# Altium schematic sheet BMU_V50_MCUcomplex.SchDoc
size C
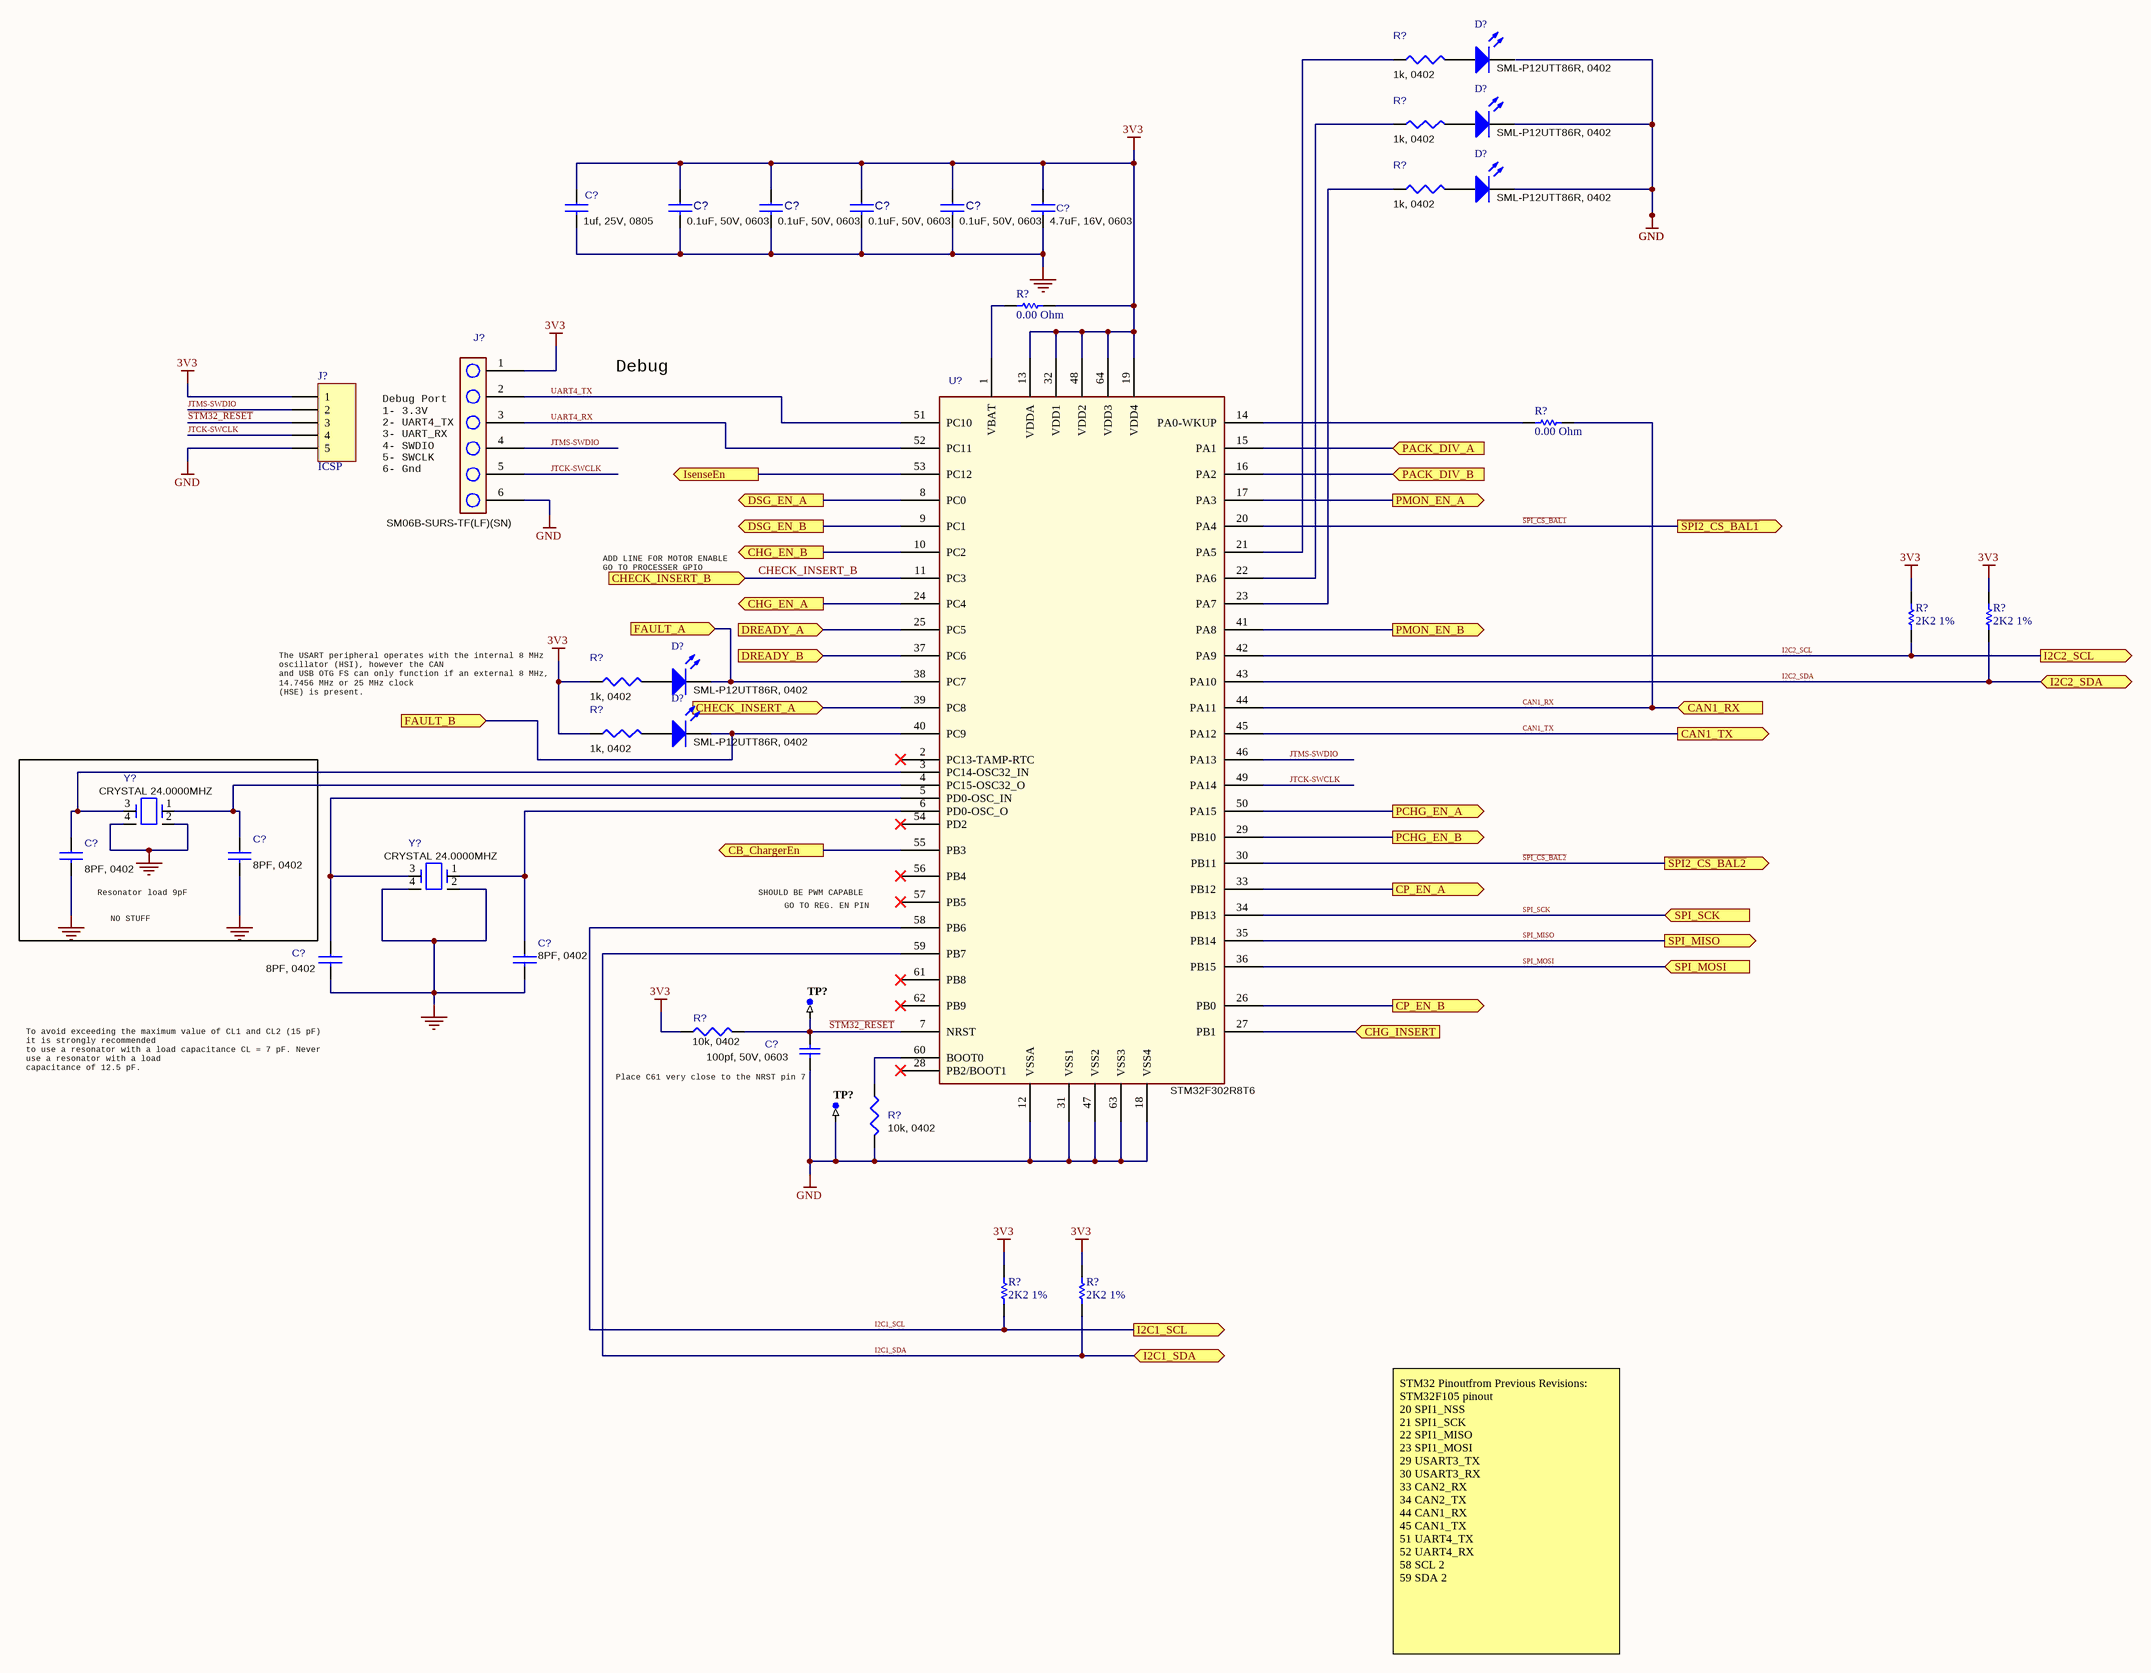
[diagram p0: BMU_V50_MCUcomplex.SchDoc]

## Parts
(Parts that share a designator on the sheet are numbered #1, #2 ... from top to bottom, then left to right.)
C?#1  1uf, 25V, 0805  [C0805]
C?#2  0.1uF, 50V, 0603  [C0603]
C?#3  0.1uF, 50V, 0603  [C0603]
C?#4  0.1uF, 50V, 0603  [C0603]
C?#5  0.1uF, 50V, 0603  [C0603]
C?#6  4.7uF, 16V, 0603  [C0805]
C?#7  8PF, 0402  [C0402]
C?#8  8PF, 0402  [C0402]
C?#9  8PF, 0402  [C0402]
C?#10  8PF, 0402  [C0402]
C?#11  100pf, 50V, 0603  [C0603]
D?#1  SML-P12UTT86R, 0402  [D0402_1]
D?#2  SML-P12UTT86R, 0402  [D0402_1]
D?#3  SML-P12UTT86R, 0402  [D0402_1]
D?#4  SML-P12UTT86R, 0402  [D0402_1]
D?#5  SML-P12UTT86R, 0402  [D0402_1]
J?#1  SM06B-SURS-TF(LF)(SN)  [0.8mm]
J?#2  ICSP  [TC2030-MCP-NL]  (no BOM)
R?#1  1k, 0402  [R0402]
R?#2  1k, 0402  [R0402]
R?#3  1k, 0402  [R0402]
R?#4  value 0.00 Ohm  [RESC0402(1005)_L]  (hidden comment: Jumper 0402(1005))
R?#5  value 0.00 Ohm  [RESC0402(1005)_L]  (hidden comment: Jumper 0402(1005))
R?#6  2K2 1%  [RESC0402(1005)_L]
R?#7  2K2 1%  [RESC0402(1005)_L]
R?#8  1k, 0402  [R0402]
R?#9  1k, 0402  [R0402]
R?#10  10k, 0402  [R0402]
R?#11  10k, 0402  [R0402]
R?#12  2K2 1%  [RESC0402(1005)_L]
R?#13  2K2 1%  [RESC0402(1005)_L]
TP?#1  TP-SM-C-100  [TP-SM-C-100]  (value not drawn)  (no BOM)
TP?#2  TP-SM-C-100  [TP-SM-C-100]  (value not drawn)  (no BOM)
U?  STM32F302R8T6  [64LQFP]
Y?#1  CRYSTAL 24.0000MHZ  [CRYSTAL_NX3225SA]
Y?#2  CRYSTAL 24.0000MHZ  [CRYSTAL_NX3225SA]

## Ports
CAN1_RX (in), CAN1_TX (out), CB_ChargerEn (out), CHECK_INSERT_A (in), CHECK_INSERT_B (in), CHG_EN_A (out), CHG_EN_B (out), CHG_INSERT (in), CP_EN_A (out), CP_EN_B (out), DREADY_A (in), DREADY_B (in), DSG_EN_A (out), DSG_EN_B (out), FAULT_A (in), FAULT_B (in), I2C1_SCL (out), I2C1_SDA (bidir), I2C2_SCL (out), I2C2_SDA (bidir), IsenseEn (out), PACK_DIV_A (in), PACK_DIV_B (in), PCHG_EN_A (out), PCHG_EN_B (out), PMON_EN_A (out), PMON_EN_B (out), SPI_MISO (out), SPI_MOSI (in), SPI_SCK (in), ~{SPI2_CS_BAL1} (out), ~{SPI2_CS_BAL2} (out)

## Nets
3V3: C?#1.1 C?#2.1 C?#3.1 C?#4.1 C?#5.1 C?#6.1 J?#1.1 J?#2.1 R?#4.1 R?#6.2 R?#7.2 R?#8.1 R?#9.1 R?#10.1 R?#12.2 R?#13.2 U?.13(VDDA) U?.19(VDD4) U?.32(VDD1) U?.48(VDD2) U?.64(VDD3)
GND: C?#1.2 C?#2.2 C?#3.2 C?#4.2 C?#5.2 C?#6.2 C?#7.2 C?#8.2 C?#9.2 C?#10.2 C?#11.1 D?#2.2(K) D?#3.2(K) J?#1.6 J?#2.5 R?#11.2 TP?#2.1 U?.12(VSSA) U?.18(VSS4) U?.31(VSS1) U?.47(VSS2) U?.63(VSS3) Y?#1.2 Y?#1.4 Y?#2.2 Y?#2.4
CAN1_RX: R?#5.1 U?.44(PA11) ; port CAN1_RX
CAN1_TX: U?.45(PA12) ; port CAN1_TX
CB_ChargerEn: U?.55(PB3) ; port CB_ChargerEn
CHECK_INSERT_A: U?.39(PC8) ; port CHECK_INSERT_A
CHECK_INSERT_B: U?.11(PC3) ; port CHECK_INSERT_B
CHG_EN_A: U?.24(PC4) ; port CHG_EN_A
CHG_EN_B: U?.10(PC2) ; port CHG_EN_B
CHG_INSERT: U?.27(PB1) ; port CHG_INSERT
CP_EN_A: U?.33(PB12) ; port CP_EN_A
CP_EN_B: U?.26(PB0) ; port CP_EN_B
DREADY_A: U?.25(PC5) ; port DREADY_A
DREADY_B: U?.37(PC6) ; port DREADY_B
DSG_EN_A: U?.8(PC0) ; port DSG_EN_A
DSG_EN_B: U?.9(PC1) ; port DSG_EN_B
FAULT_A: D?#4.2(K) U?.38(PC7) ; port FAULT_A
FAULT_B: D?#5.2(K) U?.40(PC9) ; port FAULT_B
I2C1_SCL: R?#12.1 U?.58(PB6) ; port I2C1_SCL
I2C1_SDA: R?#13.1 U?.59(PB7) ; port I2C1_SDA
I2C2_SCL: R?#6.1 U?.42(PA9) ; port I2C2_SCL
I2C2_SDA: R?#7.1 U?.43(PA10) ; port I2C2_SDA
IsenseEn: U?.53(PC12) ; port IsenseEn
JTCK-SWCLK: J?#1.5 J?#2.4 U?.49(PA14)
JTMS-SWDIO: J?#1.4 J?#2.2 U?.46(PA13)
PACK_DIV_A: U?.15(PA1) ; port PACK_DIV_A
PACK_DIV_B: U?.16(PA2) ; port PACK_DIV_B
PCHG_EN_A: U?.50(PA15) ; port PCHG_EN_A
PCHG_EN_B: U?.29(PB10) ; port PCHG_EN_B
PMON_EN_A: U?.17(PA3) ; port PMON_EN_A
PMON_EN_B: U?.41(PA8) ; port PMON_EN_B
~{SPI_CS_BAL1}: U?.20(PA4) ; port ~{SPI2_CS_BAL1}
~{SPI_CS_BAL2}: U?.30(PB11) ; port ~{SPI2_CS_BAL2}
~{STM32_RESET}: C?#11.2 J?#2.3 R?#10.2 TP?#1.1 U?.7(NRST)
SPI_MISO: U?.35(PB14) ; port SPI_MISO
SPI_MOSI: U?.36(PB15) ; port SPI_MOSI
SPI_SCK: U?.34(PB13) ; port SPI_SCK
UART4_RX: J?#1.3 U?.52(PC11)
UART4_TX: J?#1.2 U?.51(PC10)
NetC?#7_1: C?#7.1 U?.3(PC14-OSC32_IN) Y?#1.3
NetC?#8_1: C?#8.1 U?.4(PC15-OSC32_O) Y?#1.1
NetC?#9_1: C?#9.1 U?.5(PD0-OSC_IN) Y?#2.3
NetC?#10_1: C?#10.1 U?.6(PD0-OSC_O) Y?#2.1
NetR?#1_1: R?#1.1 U?.21(PA5)
NetR?#2_1: R?#2.1 U?.22(PA6)
NetR?#3_1: R?#3.1 U?.23(PA7)
NetR?#4_2: R?#4.2 U?.1(VBAT)
NetR?#5_2: R?#5.2 U?.14(PA0-WKUP)
NetR?#11_1: R?#11.1 U?.60(BOOT0)

Not connected (* = marked no-connect by the designer): D?#1 1(A) 2(K); D?#2 1(A); D?#3 1(A); D?#4 1(A); D?#5 1(A); R?#1 2; R?#2 2; R?#3 2; R?#8 2; R?#9 2; U? 2(PC13-TAMP-RTC)* 28(PB2/BOOT1)* 54(PD2)* 56(PB4)* 57(PB5)* 61(PB8)* 62(PB9)*

## Notes on the sheet
- Debug
- (near J?#1) Debug Port
  1- 3.3V
  2- UART4_TX
  3- UART_RX
  4- SWDIO
  5- SWCLK
  6- Gnd
- ADD LINE FOR MOTOR ENABLE
  GO TO PROCESSER GPIO
- (near R?#8) The USART peripheral operates with the internal 8 MHz
  oscillator (HSI), however the CAN
  and USB OTG FS can only function if an external 8 MHz,
  14.7456 MHz or 25 MHz clock
  (HSE) is present.
- (near C?#7) Resonator load 9pF
- NO STUFF
- SHOULD BE PWM CAPABLE
- GO TO REG. EN PIN
- To avoid exceeding the maximum value of CL1 and CL2 (15 pF)
  it is strongly recommended
  to use a resonator with a load capacitance CL = 7 pF. Never
  use a resonator with a load
  capacitance of 12.5 pF.
- (near C?#11) Place C61 very close to the NRST pin 7
- STM32 Pinoutfrom Previous Revisions:
  STM32F105 pinout
  20 SPI1_NSS
  21 SPI1_SCK
  22 SPI1_MISO
  23 SPI1_MOSI
  29 USART3_TX
  30 USART3_RX
  33 CAN2_RX
  34 CAN2_TX
  44 CAN1_RX
  45 CAN1_TX
  51 UART4_TX
  52 UART4_RX
  58 SCL 2
  59 SDA 2
- Title
- MATTERNET
- PROPRIETRY & CONFIDENTIAL
  THE INFORMATION CONTAINS IN THIS DRAWING
  IS THE SOLE PROPERTY OF  MATTERNET Inc.
  ANY REPRODUCTION IN PART OR AS WHOLE
  WITHOUT A WRITTEN PERMISSION OF
  MATTERNET Inc. IS PROHIBITED
- Size:
- Date:
- File:
- C
- Number:
- Time:
- Revision:
- Sheet
- of
- 161 E. Evelyn Ave.
- Mountain View,
- CA 94041 USA

## Library data of the parts
C?#1 = CAP-Generic-0402: CAP CER 1UF 25V X7R 0805; Manufacturer: Murata; Manufacturer Part Number: GCJ21BR71E105KA12L; Tolerance: 10%; Supplier 1: Digi-Key; Supplier Part Number 1: 490-5802-1-ND; Stock 1: 116649; Pricing 1: 1=0.48, 10=0.333, 100=0.1997, 500=0.14974, 1000=0.12645 (USD); Mount: Surface Mount; Case/Package: 0805; Case Code (Imperial): 0805; Case Code (Metric): 2012; Min Operating Temperature: -55°C; Max Operating Temperature: 125°C; Capacitance: 1uF; Voltage Rating: 25V; Voltage Rating (DC): 25V; Packaging: Tape and Reel; Package Quantity: 3000; Dielectric: X7R; Termination: SMD/SMT; Features: Soft Termination; Length: 2mm; Width: 1.25mm; Thickness: 0.057inch; Depth: 1.25mm; Ratings: AEC-Q200; Lead Free: Lead Free
C?#2-C?#5 = CAP-Generic-0603: CAP CER 0.1UF 50V 10% X7R 0603; Manufacturer: Murata; Manufacturer Part Number: GCJ188R71E104KA12D; Supplier 1: Digi-Key; Supplier Part Number 1: 490-16477-1-ND; Stock 1: 2560; Pricing 1: 1=0.22, 10=0.152, 100=0.077, 500=0.0527, 1000=0.04662 (USD); Case/Package: 0603; Supplier 2: Mouser; Supplier Part Number 2: 81-GCJ188R71E104KA2D; Stock 2: 47905; Pricing 2: 1=0.21, 10=0.139, 50=0.139, 100=0.071, 1000=0.043, 10000=0.035 (USD)
C?#6 = CAP-Generic-0603: CAP CER 4.7UF 16V 10% X7R 0805; Manufacturer: TDK; Manufacturer Part Number: CGA4J3X7R1C475K125AE; Supplier 1: Digi-Key; Supplier Part Number 1: 445-8788-1-ND; Stock 1: 255080; Pricing 1: 1=0.7, 10=0.498, 100=0.3279, 500=0.24288, 1000=0.20645 (USD); Mount: Surface Mount; Case/Package: 0805; Weight: 0.000194oz; Case Code (Imperial): 0805; Case Code (Metric): 2012; Min Operating Temperature: -55°C; Max Operating Temperature: 125°C; Capacitance: 4.7uF; Tolerance: 10%; Packaging: Tape and Reel; Voltage Rating: 16V; Termination: SMD/SMT; Voltage Rating (DC): 16V; Package Quantity: 1; Dielectric: X7R; Features: Soft Termination; Length: 2mm; Height: 1.25mm; Width: 1.2mm; Thickness: 0.057inch; Depth: 1.25mm; Ratings: AEC-Q200; REACH SVHC: No SVHC; ComponentLink1URL: http://www.mouser.com/ds/2/400/lcc_commercial_soft_en-775842.pdf?src-supplier=Mouser; ComponentLink1Description: http://www.mouser.com/ds/2/400/lcc_commercial_soft_en-775842.pdf?src-supplier=Mouser; ComponentLink2URL: http://www.farnell.com/datasheets/1863333.pdf?src-supplier=Element14; ComponentLink2Description: http://www.farnell.com/datasheets/1863333.pdf?src-supplier=Element14; Supplier 2: Mouser; Supplier Part Number 2: 810-CGA4J3X7R1C475KS; Stock 2: 3160; Pricing 2: 1=0.7, 10=0.498, 50=0.498, 100=0.328, 1000=0.207, 10000=0.176 (USD)
C?#7-C?#10 = CAP-Generic-0402: CAP CER 8PF 50V C0G 0402; Manufacturer: TDK; Manufacturer Part Number: CGA2B2C0G1H080D050BA; ComponentLink1URL: http://www.mouser.com/ds/2/400/lcc_commercial_general_en-837201.pdf; ComponentLink1Description: http://www.mouser.com/ds/2/400/lcc_commercial_general_en-837201.pdf; ComponentLink2URL: https://product.tdk.com/info/en/documents/chara_sheet/C1005C0G1H080C050BA.pdf; ComponentLink2Description: https://product.tdk.com/info/en/documents/chara_sheet/C1005C0G1H080C050BA.pdf; Supplier 1: Digi-Key; Supplier Part Number 1: 445-5582-1-ND; Stock 1: 4049; Pricing 1: 1=0.1, 10=0.076, 100=0.0338, 500=0.02416, 1000=0.01898, 2500=0.01725, 5000=0.01587 (USD); Mount: Surface Mount; Case/Package: 0402; Weight: 2.3E-05oz; Case Code (Imperial): 0402; Case Code (Metric): 1005; Min Operating Temperature: -55°C; Max Operating Temperature: 125°C; Capacitance: 8pF; Voltage Rating: 50V; Voltage Rating (DC): 50V; Packaging: Tape and Reel; Dielectric: C0G; Termination: SMD/SMT; Package Quantity: 10000; Composition: Ceramic; Length: 1mm; Height: 0.5mm; Width: 0.5mm; Thickness: 0.022inch; Depth: 0.5mm; Ratings: AEC-Q200; REACH SVHC: No SVHC; ComponentLink3URL: http://www.mouser.com/ds/2/400/lcc_automotive_general_en-843974.pdf; ComponentLink3Description: http://www.mouser.com/ds/2/400/lcc_automotive_general_en-843974.pdf; ComponentLink4URL: http://www.farnell.com/datasheets/1807242.pdf; ComponentLink4Description: http://www.farnell.com/datasheets/1807242.pdf
C?#11 = Cap: CAP CER 100PF 50V NP0 0603; Manufacturer: TDK; Manufacturer Part Number: CGA3E2C0G1H101J080AE; Tolerance: 5%; Supplier 1: Digi-Key; Supplier Part Number 1: 445-173653-1-ND; Stock 1: 2011; Pricing 1: 1=0.27, 10=0.186, 100=0.0944, 500=0.06458, 1000=0.05713 (USD); Mount: Surface Mount; Case/Package: 0603; Case Code (Metric): 1608; Case Code (Imperial): 0603; Min Operating Temperature: -55°C; Max Operating Temperature: 125°C; Packaging: Tape and Reel; Capacitance: 100pF; Voltage Rating: 50V; Features: Soft Termination; Length: 0.063inch; Width: 0.031inch; Thickness: 0.037inch; Ratings: AEC-Q200; Supplier 2: Mouser; Supplier Part Number 2: 810-CGA3E2C0G1H101JA; Stock 2: 41170; Pricing 2: 1=0.27, 10=0.186, 50=0.186, 100=0.095, 1000=0.058, 10000=0.044 (USD)
D?#1-D?#5 = LED0: LED Uni-Color Red Chip LED 2-Pin 0402 T/R; Manufacturer: Rohm; Manufacturer Part Number: SML-P12U2TT86R; Lens Color: Colorless; Lens Transparency: Clear; Luminous Intensity: 70mcd; Test Current: 20mA; Dominant Wavelength: 615nm; Forward Voltage: 2V; Supplier 1: Digi-Key; Supplier Part Number 1: 846-1192-1-ND; Stock 1: 9518; Pricing 1: 1=0.45, 10=0.327, 25=0.2504, 100=0.1634, 250=0.1198, 500=0.10164, 1000=0.08349, 2500=0.0726 (USD); Mount: Surface Mount; Case/Package: 0402; Color: Red; Case Code (Metric): 1006; Case Code (Imperial): 0402; Packaging: Cut Tape; Length: 1mm; Height: 0.25mm; Width: 0.6mm; Lead Free: Lead Free; Supplier 2: Mouser; Supplier Part Number 2: 755-SML-P12U2TT86R; Stock 2: 13361; Pricing 2: 1=0.37, 10=0.238, 50=0.238, 100=0.102, 1000=0.079, 10000=0.06 (USD)
J?#1 = CONN-GENERIC-1X6: Headers & Wire Housings 6P SR UNSHRD HRD TIN OVER NI; Manufacturer: JST; custprt: 100-0410-000212; custinv: Ansync; Option: A; Number of Positions: 6; Connector Type: Outer Shroud Contact; Pitch: 0.031inch; Supplier 1: Digi-Key; Supplier Part Number 1: SM06B-SURS-TF(LF)(SN)-ND; Manufacturer Part Number: SM06B-SURS-TF(LF)(SN); Stock 1: 0; Pricing 1: 3500=0.43193 (USD); Mount: Surface Mount; Colour: Natural; Contact Plating: Tin; Number of Rows: 1; Packaging: Tape and Reel; Termination: Solder; ComponentLink1URL: http://www.jst-mfg.com/product/pdf/eng/eSUR.pdf; ComponentLink1Description: http://www.jst-mfg.com/product/pdf/eng/eSUR.pdf
R?#1-R?#3 R?#8 R?#9 = R-Generic-0402: RES SMD 1K OHM 5% 1/16W 0402; Manufacturer: Yageo; Manufacturer Part Number: RC0402JR-071KL; custinv: Ansync; custprt: 100-0120-000074; Option: AB; Resistance: 1kR; Power Rating: 62.5mW; Voltage Rating: 50V; Temperature Coefficient: 100ppm/°C; Max Power Dissipation: 63mW; Supplier 1: Digi-Key; Supplier Part Number 1: 311-1.0KJRCT-ND; Stock 1: 18546768; Pricing 1: 1=0.1, 10=0.015, 100=0.006, 1000=0.00268, 2500=0.00233, 5000=0.00192 (USD); Case/Package: 0402; Case Code (Imperial): 0402; Case Code (Metric): 1005; Min Operating Temperature: -55°C; Max Operating Temperature: 155°C; Tolerance: 5%; Packaging: Tape and Reel; Package Quantity: 1; Termination: SMD/SMT; Composition: Thick Film; Number of Terminations: 2; Military Standard: Not; Features: Moisture Resistant; Length: 0.039inch; Height: 0.016inch; Width: 0.02inch; Depth: 0.5mm; REACH SVHC: No SVHC; Lead Free: Lead Free; ComponentLink1URL: http://www.yageo.com/documents/recent/PYu-RC_Group_51_RoHS_L_9.pdf; ComponentLink1Description: http://www.yageo.com/documents/recent/PYu-RC_Group_51_RoHS_L_9.pdf; ComponentLink2URL: http://www.farnell.com/datasheets/1018594.pdf; ComponentLink2Description: http://www.farnell.com/datasheets/1018594.pdf; ComponentLink3URL: http://www.yageo.com/documents/recent/PYu-RC0402_51_RoHS_L_6_r.pdf; ComponentLink3Description: http://www.yageo.com/documents/recent/PYu-RC0402_51_RoHS_L_6_r.pdf
R?#4 R?#5 = CMP-1011-00001-1: Jumper 0402 (1005 Metric); Tolerance: None; Case-Metric: 1005; Case-EIA: 0402; Power: None; Technology: SMT
R?#6 R?#7 R?#12 R?#13 = CMP-1011-00546-1: 2K2 0.063W 1% 0402 (1005 Metric)  SMD; Case-Metric: 1005; Case-EIA: 0402; Value: 2200.00 Ohm; Power: 0.063 W; Tolerance: 1 %; Technology: SMT
R?#10 R?#11 = R-Generic-0402: RES SMD 10K OHM 1% 1/16W 0402; Manufacturer: Vishay Dale; Manufacturer Part Number: CRCW040210K0FKTD; Resistance: 10kR; Power Rating: 63mW; Voltage Rating: 50V; Temperature Coefficient: 100ppm/°C; ComponentLink1URL: http://www.yageo.com/documents/recent/PYu-RC_Group_51_RoHS_L_9.pdf; ComponentLink1Description: http://www.yageo.com/documents/recent/PYu-RC_Group_51_RoHS_L_9.pdf; ComponentLink2URL: http://www.mouser.com/ds/2/447/PYu-RC0402_51_RoHS_L_6_r-8721.pdf; ComponentLink2Description: http://www.mouser.com/ds/2/447/PYu-RC0402_51_RoHS_L_6_r-8721.pdf; ComponentLink3URL: http://www.farnell.com/datasheets/1018594.pdf; ComponentLink3Description: http://www.farnell.com/datasheets/1018594.pdf; Supplier 1: Digi-Key; Supplier Part Number 1: 541-2955-1-ND; Stock 1: 17223; Pricing 1: 1=0.15, 10=0.132, 100=0.0508, 1000=0.02236, 2500=0.01931, 5000=0.01728 (USD); Mount: Surface Mount; Case/Package: 0402; Number of Pins: 2; Weight: 2.3E-05oz; Case Code (Metric): 1005; Case Code (Imperial): 0402; Contact Plating: Lead,Tin; Min Operating Temperature: -55°C; Max Operating Temperature: 155°C; Tolerance: 1%; Packaging: Tape and Reel; Package Quantity: 10000; Composition: Thick Film; Number of Terminations: 2; Military Standard: Not; Max Power Dissipation: 63mW; Voltage Rating (DC): 50V; Features: Automotive AEC-Q200; Length: 1mm; Height: 0.016inch; Width: 0.02inch; Depth: 0.5mm; Radiation Hardening: No; Lead Free: Contains Lead; REACH SVHC: Unknown; ComponentLink4URL: http://www.vishay.com/docs/20008/dcrcw.pdf?src-supplier=Digi-Key; ComponentLink4Description: http://www.vishay.com/docs/20008/dcrcw.pdf?src-supplier=Digi-Key; ComponentLink5URL: https://www.verical.com/server-webapp/html/getDatasheet?partID=104182&src-supplier=Verical; ComponentLink5Description: https://www.verical.com/server-webapp/html/getDatasheet?partID=104182&src-supplier=Verical; ComponentLink6URL: http://www.vishay.com/docs/20008/dcrcw.pdf?src-supplier=Avnet; ComponentLink6Description: http://www.vishay.com/docs/20008/dcrcw.pdf?src-supplier=Avnet
TP?#1 TP?#2 = CMP-0484-00002-2: Test Point, Surface Mount, Circular, Pad Diameter 1 mm; Manufacturer: No Vendor; PartNumber: TP-SM-C-100
U? = MCU-STM32F105RBT6-700-443: MCU 32-bit STM32 ARM Cortex M4 RISC 128KB Flash 2.5V/3.3V 64-Pin LQFP Tray; Manufacturer 1: STMicroelectronics; Manufacturer Part Number 1: STM32F302RBT6; Peripherals: POR,PWM,WDT,DMA; Interface: I2C,SPI,USB,CAN,I2S,UART,USART,IrDA,LIN; Number of I/Os: 27; Frequency: 72MHz; Oscillator Type: Internal; Number of USB Channels: 1; Number of SPI Channels: 3; Number of I2C Channels: 2; Number of PWM Channels: 6; Number of Programmable I/O: 52; Min Supply Voltage: 2V; Watchdog Timer: Yes; RAM Size: 32KB; Number of Timers/Counters: 8; Max Supply Voltage: 3.6V; Data Bus Width: 32b; ComponentLink1URL: http://www.st.com/web/en/resource/technical/document/datasheet/DM00094064.pdf; ComponentLink1Description: http://www.st.com/web/en/resource/technical/document/datasheet/DM00094064.pdf; ComponentLink2URL: http://www.farnell.com/datasheets/1824148.pdf; ComponentLink2Description: http://www.farnell.com/datasheets/1824148.pdf; ComponentLink3URL: https://datasheet.ciiva.com/12270/dm00058181-101707-12270628.pdf?src-supplier=Mouser; ComponentLink3Description: https://datasheet.ciiva.com/12270/dm00058181-101707-12270628.pdf?src-supplier=Mouser; ComponentLink4URL: https://datasheet.ciiva.com/22691/1880973-22691996.pdf?src-supplier=Element14; ComponentLink4Description: https://datasheet.ciiva.com/22691/1880973-22691996.pdf?src-supplier=Element14; ComponentLink5URL: https://datasheet.ciiva.com/29719/dm00094064-29719691.pdf?src-supplier=Digi-Key; ComponentLink5Description: https://datasheet.ciiva.com/29719/dm00094064-29719691.pdf?src-supplier=Digi-Key; Supplier 1: Digi-Key; Supplier Part Number 1: 497-17416-ND; RoHS: Yes; Category: Microcontrollers; Stock 1: 1015; Pricing 1: 1=4.79000, 10=4.30300, 25=4.06760, 100=3.52540, 250=3.34460, 500=3.00112, 1000=2.53106, 2500=2.40451, 5000=2.31411 (USD); Case/Package: LQFP; Number of Pins: 64; Contact Plating: Gold; Min Operating Temperature: -40°C; Max Operating Temperature: 85°C; Memory Type: FLASH; Memory Size: 128KB; Core Architecture: ARM; Packaging: Tray; Max Frequency: 72MHz; Number of UART Channels: 2; Number of ADC Channels: 1; Package Quantity: 960; Length: 10.2mm; Height: 1.45mm; Width: 10.2mm; Radiation Hardening: No; REACH SVHC: No SVHC; Lead Free: Lead Free
Y?#1 Y?#2 = CRY-Generic: CRYSTAL 24.0000MHZ 8PF SMD; Manufacturer: NDK; Manufacturer Part Number: NX3225SA-24.000MHZ-STD-CSR-1; custinv: Ansync; custprt: 100-0830-000044; Option: AB; Frequency: 24MHz; Frequency Tolerance: 15ppm; ESR (Equivalent Series Resistance): 50R; Supplier 1: Digi-Key; Supplier Part Number 1: 644-1052-1-ND; Stock 1: 48121; Pricing 1: 1=0.75, 10=0.663, 50=0.6196, 100=0.5476, 500=0.51876, 1000=0.4323 (USD); Mount: Surface Mount; Case/Package: SMD/SMT; Min Operating Temperature: -10°C; Max Operating Temperature: 75°C; Packaging: Tape and Reel; Load Capacitance: 8pF; Frequency Stability: 15ppm; Length: 0.126inch; Height: 0.028inch; Width: 0.098inch; Supplier 2: Mouser; Supplier Part Number 2: 344-NX3225SA24MCSR1; Stock 2: 5833; Pricing 2: 1=0.71, 10=0.587, 50=0.587, 100=0.519, 1000=0.41, 10000=0.335 (USD)